# Altium schematic sheet DDR3_TOP_LEVEL.SchDoc
size A3; DocumentNumber: 3; SheetNumber: 3; SheetTotal: 47
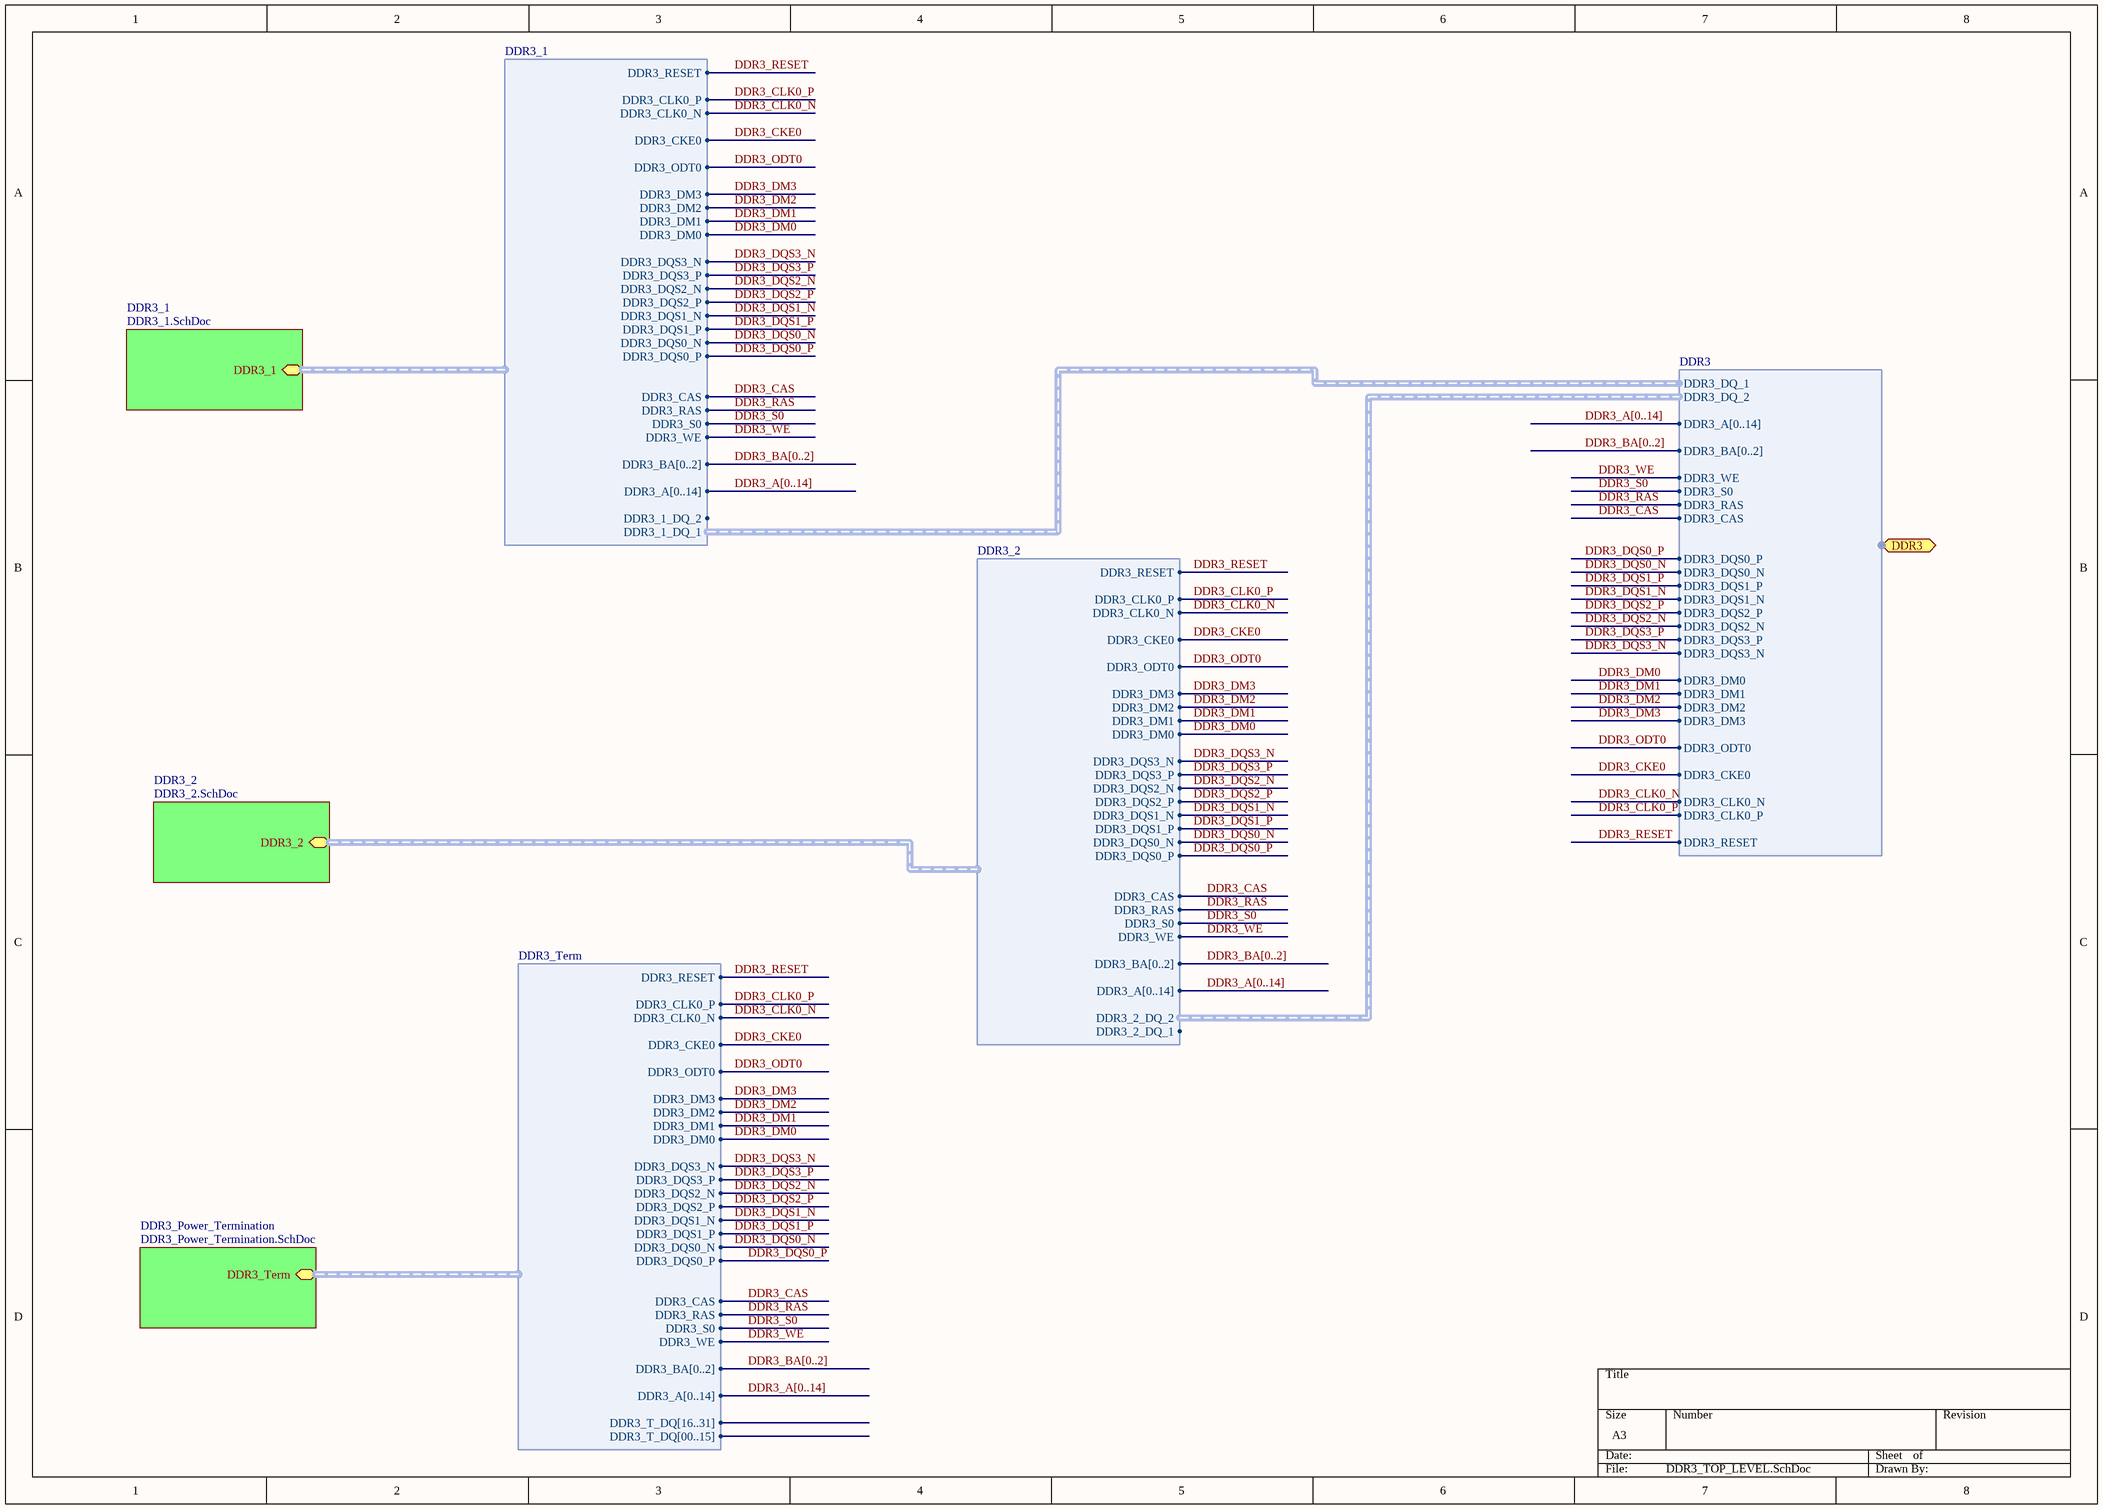
[diagram p0: DDR3_TOP_LEVEL.SchDoc]

## Sub-sheets
DDR3_1 = DDR3_1.SchDoc: DDR3_1 (harness DDR3_1)
DDR3_2 = DDR3_2.SchDoc: DDR3_2 (harness DDR3_2)
DDR3_Power_Termination = DDR3_Power_Termination.SchDoc: DDR3_Term (harness DDR3_Term)

## Ports
DDR3 (harness DDR3)

## Harnesses
DDR3: DDR3_DQ_1, DDR3_DQ_2, DDR3_A[0..14], DDR3_BA[0..2], DDR3_WE, DDR3_S0, DDR3_RAS, DDR3_CAS, DDR3_DQS0_P, DDR3_DQS0_N, DDR3_DQS1_P, DDR3_DQS1_N, DDR3_DQS2_P, DDR3_DQS2_N, DDR3_DQS3_P, DDR3_DQS3_N, DDR3_DM0, DDR3_DM1, DDR3_DM2, DDR3_DM3, DDR3_ODT0, DDR3_CKE0, DDR3_CLK0_N, DDR3_CLK0_P, DDR3_RESET
DDR3_1: DDR3_1_DQ_1, DDR3_1_DQ_2, DDR3_A[0..14], DDR3_BA[0..2], DDR3_WE, DDR3_S0, DDR3_RAS, DDR3_CAS, DDR3_DQS0_P, DDR3_DQS0_N, DDR3_DQS1_P, DDR3_DQS1_N, DDR3_DQS2_P, DDR3_DQS2_N, DDR3_DQS3_P, DDR3_DQS3_N, DDR3_DM0, DDR3_DM1, DDR3_DM2, DDR3_DM3, DDR3_ODT0, DDR3_CKE0, DDR3_CLK0_N, DDR3_CLK0_P, DDR3_RESET
DDR3_2: DDR3_2_DQ_1, DDR3_2_DQ_2, DDR3_A[0..14], DDR3_BA[0..2], DDR3_WE, DDR3_S0, DDR3_RAS, DDR3_CAS, DDR3_DQS0_P, DDR3_DQS0_N, DDR3_DQS1_P, DDR3_DQS1_N, DDR3_DQS2_P, DDR3_DQS2_N, DDR3_DQS3_P, DDR3_DQS3_N, DDR3_DM0, DDR3_DM1, DDR3_DM2, DDR3_DM3, DDR3_ODT0, DDR3_CKE0, DDR3_CLK0_N, DDR3_CLK0_P, DDR3_RESET
DDR3_Term: DDR3_T_DQ[00..15], DDR3_T_DQ[16..31], DDR3_A[0..14], DDR3_BA[0..2], DDR3_WE, DDR3_S0, DDR3_RAS, DDR3_CAS, DDR3_DQS0_P, DDR3_DQS0_N, DDR3_DQS1_P, DDR3_DQS1_N, DDR3_DQS2_P, DDR3_DQS2_N, DDR3_DQS3_P, DDR3_DQS3_N, DDR3_DM0, DDR3_DM1, DDR3_DM2, DDR3_DM3, DDR3_ODT0, DDR3_CKE0, DDR3_CLK0_N, DDR3_CLK0_P, DDR3_RESET

## Nets
DDR3_CAS: port DDR3.DDR3_CAS, sheet DDR3_1/DDR3_1.DDR3_CAS, sheet DDR3_2/DDR3_2.DDR3_CAS, sheet DDR3_Power_Termination/DDR3_Term.DDR3_CAS
DDR3_CKE0: port DDR3.DDR3_CKE0, sheet DDR3_1/DDR3_1.DDR3_CKE0, sheet DDR3_2/DDR3_2.DDR3_CKE0, sheet DDR3_Power_Termination/DDR3_Term.DDR3_CKE0
DDR3_CLK0_N: port DDR3.DDR3_CLK0_N, sheet DDR3_1/DDR3_1.DDR3_CLK0_N, sheet DDR3_2/DDR3_2.DDR3_CLK0_N, sheet DDR3_Power_Termination/DDR3_Term.DDR3_CLK0_N
DDR3_CLK0_P: port DDR3.DDR3_CLK0_P, sheet DDR3_1/DDR3_1.DDR3_CLK0_P, sheet DDR3_2/DDR3_2.DDR3_CLK0_P, sheet DDR3_Power_Termination/DDR3_Term.DDR3_CLK0_P
DDR3_DM0: port DDR3.DDR3_DM0, sheet DDR3_1/DDR3_1.DDR3_DM0, sheet DDR3_2/DDR3_2.DDR3_DM0, sheet DDR3_Power_Termination/DDR3_Term.DDR3_DM0
DDR3_DM1: port DDR3.DDR3_DM1, sheet DDR3_1/DDR3_1.DDR3_DM1, sheet DDR3_2/DDR3_2.DDR3_DM1, sheet DDR3_Power_Termination/DDR3_Term.DDR3_DM1
DDR3_DM2: port DDR3.DDR3_DM2, sheet DDR3_1/DDR3_1.DDR3_DM2, sheet DDR3_2/DDR3_2.DDR3_DM2, sheet DDR3_Power_Termination/DDR3_Term.DDR3_DM2
DDR3_DM3: port DDR3.DDR3_DM3, sheet DDR3_1/DDR3_1.DDR3_DM3, sheet DDR3_2/DDR3_2.DDR3_DM3, sheet DDR3_Power_Termination/DDR3_Term.DDR3_DM3
DDR3_DQS0_N: port DDR3.DDR3_DQS0_N, sheet DDR3_1/DDR3_1.DDR3_DQS0_N, sheet DDR3_2/DDR3_2.DDR3_DQS0_N, sheet DDR3_Power_Termination/DDR3_Term.DDR3_DQS0_N
DDR3_DQS0_P: port DDR3.DDR3_DQS0_P, sheet DDR3_1/DDR3_1.DDR3_DQS0_P, sheet DDR3_2/DDR3_2.DDR3_DQS0_P, sheet DDR3_Power_Termination/DDR3_Term.DDR3_DQS0_P
DDR3_DQS1_N: port DDR3.DDR3_DQS1_N, sheet DDR3_1/DDR3_1.DDR3_DQS1_N, sheet DDR3_2/DDR3_2.DDR3_DQS1_N, sheet DDR3_Power_Termination/DDR3_Term.DDR3_DQS1_N
DDR3_DQS1_P: port DDR3.DDR3_DQS1_P, sheet DDR3_1/DDR3_1.DDR3_DQS1_P, sheet DDR3_2/DDR3_2.DDR3_DQS1_P, sheet DDR3_Power_Termination/DDR3_Term.DDR3_DQS1_P
DDR3_DQS2_N: port DDR3.DDR3_DQS2_N, sheet DDR3_1/DDR3_1.DDR3_DQS2_N, sheet DDR3_2/DDR3_2.DDR3_DQS2_N, sheet DDR3_Power_Termination/DDR3_Term.DDR3_DQS2_N
DDR3_DQS2_P: port DDR3.DDR3_DQS2_P, sheet DDR3_1/DDR3_1.DDR3_DQS2_P, sheet DDR3_2/DDR3_2.DDR3_DQS2_P, sheet DDR3_Power_Termination/DDR3_Term.DDR3_DQS2_P
DDR3_DQS3_N: port DDR3.DDR3_DQS3_N, sheet DDR3_1/DDR3_1.DDR3_DQS3_N, sheet DDR3_2/DDR3_2.DDR3_DQS3_N, sheet DDR3_Power_Termination/DDR3_Term.DDR3_DQS3_N
DDR3_DQS3_P: port DDR3.DDR3_DQS3_P, sheet DDR3_1/DDR3_1.DDR3_DQS3_P, sheet DDR3_2/DDR3_2.DDR3_DQS3_P, sheet DDR3_Power_Termination/DDR3_Term.DDR3_DQS3_P
DDR3_ODT0: port DDR3.DDR3_ODT0, sheet DDR3_1/DDR3_1.DDR3_ODT0, sheet DDR3_2/DDR3_2.DDR3_ODT0, sheet DDR3_Power_Termination/DDR3_Term.DDR3_ODT0
DDR3_RAS: port DDR3.DDR3_RAS, sheet DDR3_1/DDR3_1.DDR3_RAS, sheet DDR3_2/DDR3_2.DDR3_RAS, sheet DDR3_Power_Termination/DDR3_Term.DDR3_RAS
DDR3_RESET: port DDR3.DDR3_RESET, sheet DDR3_1/DDR3_1.DDR3_RESET, sheet DDR3_2/DDR3_2.DDR3_RESET, sheet DDR3_Power_Termination/DDR3_Term.DDR3_RESET
DDR3_S0: port DDR3.DDR3_S0, sheet DDR3_1/DDR3_1.DDR3_S0, sheet DDR3_2/DDR3_2.DDR3_S0, sheet DDR3_Power_Termination/DDR3_Term.DDR3_S0
DDR3_WE: port DDR3.DDR3_WE, sheet DDR3_1/DDR3_1.DDR3_WE, sheet DDR3_2/DDR3_2.DDR3_WE, sheet DDR3_Power_Termination/DDR3_Term.DDR3_WE

## Buses and harness runs
bus DDR3_A[0..14]
bus DDR3_BA[0..2]